# EasyEDA Pro project ProPrj_KrabbyUno - v0.1_2026-05-19.epro, board PCB2
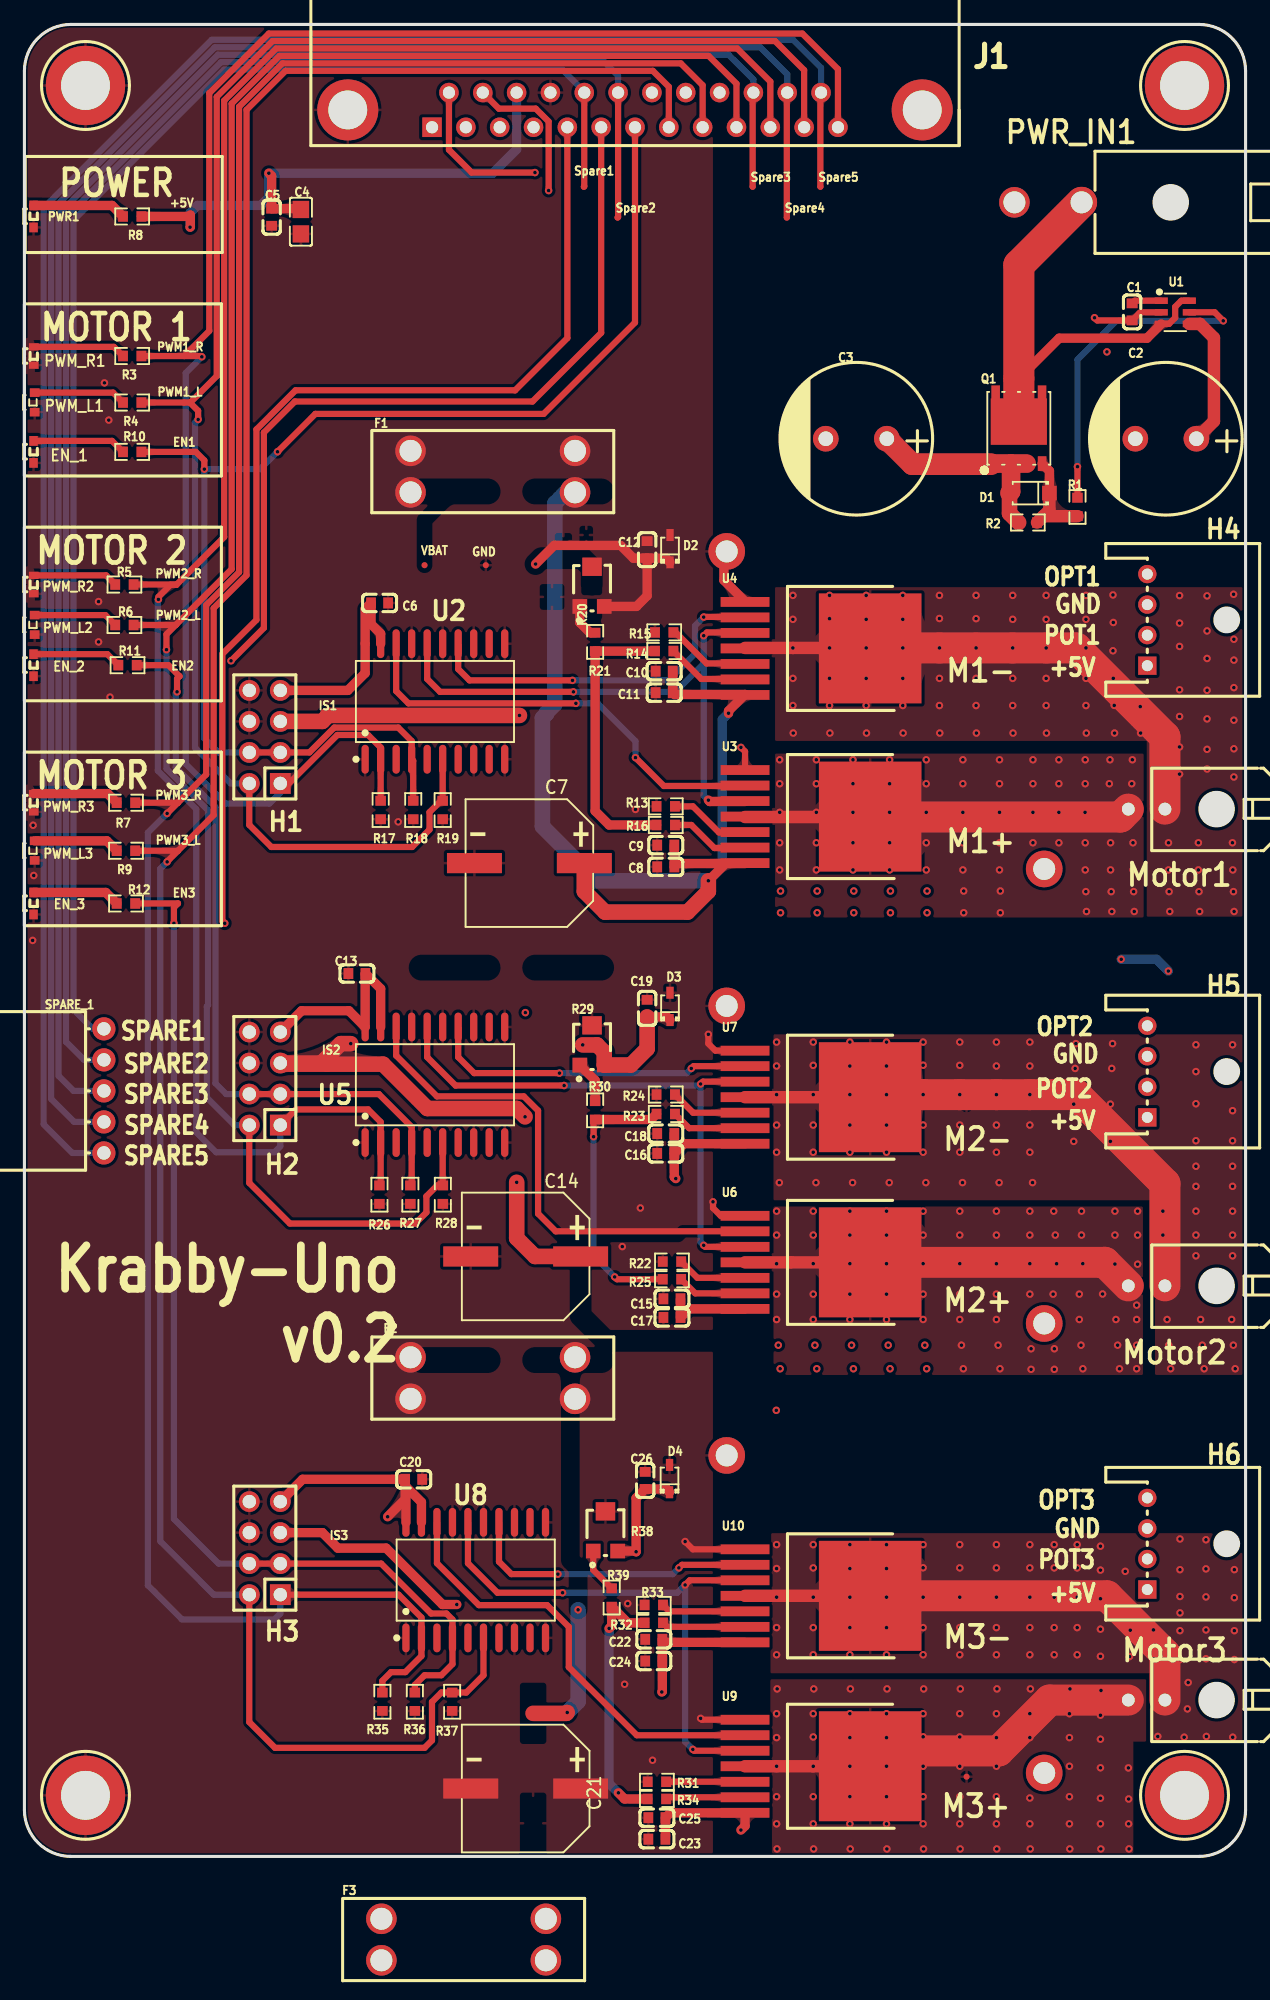
[diagram p8: board, top side]
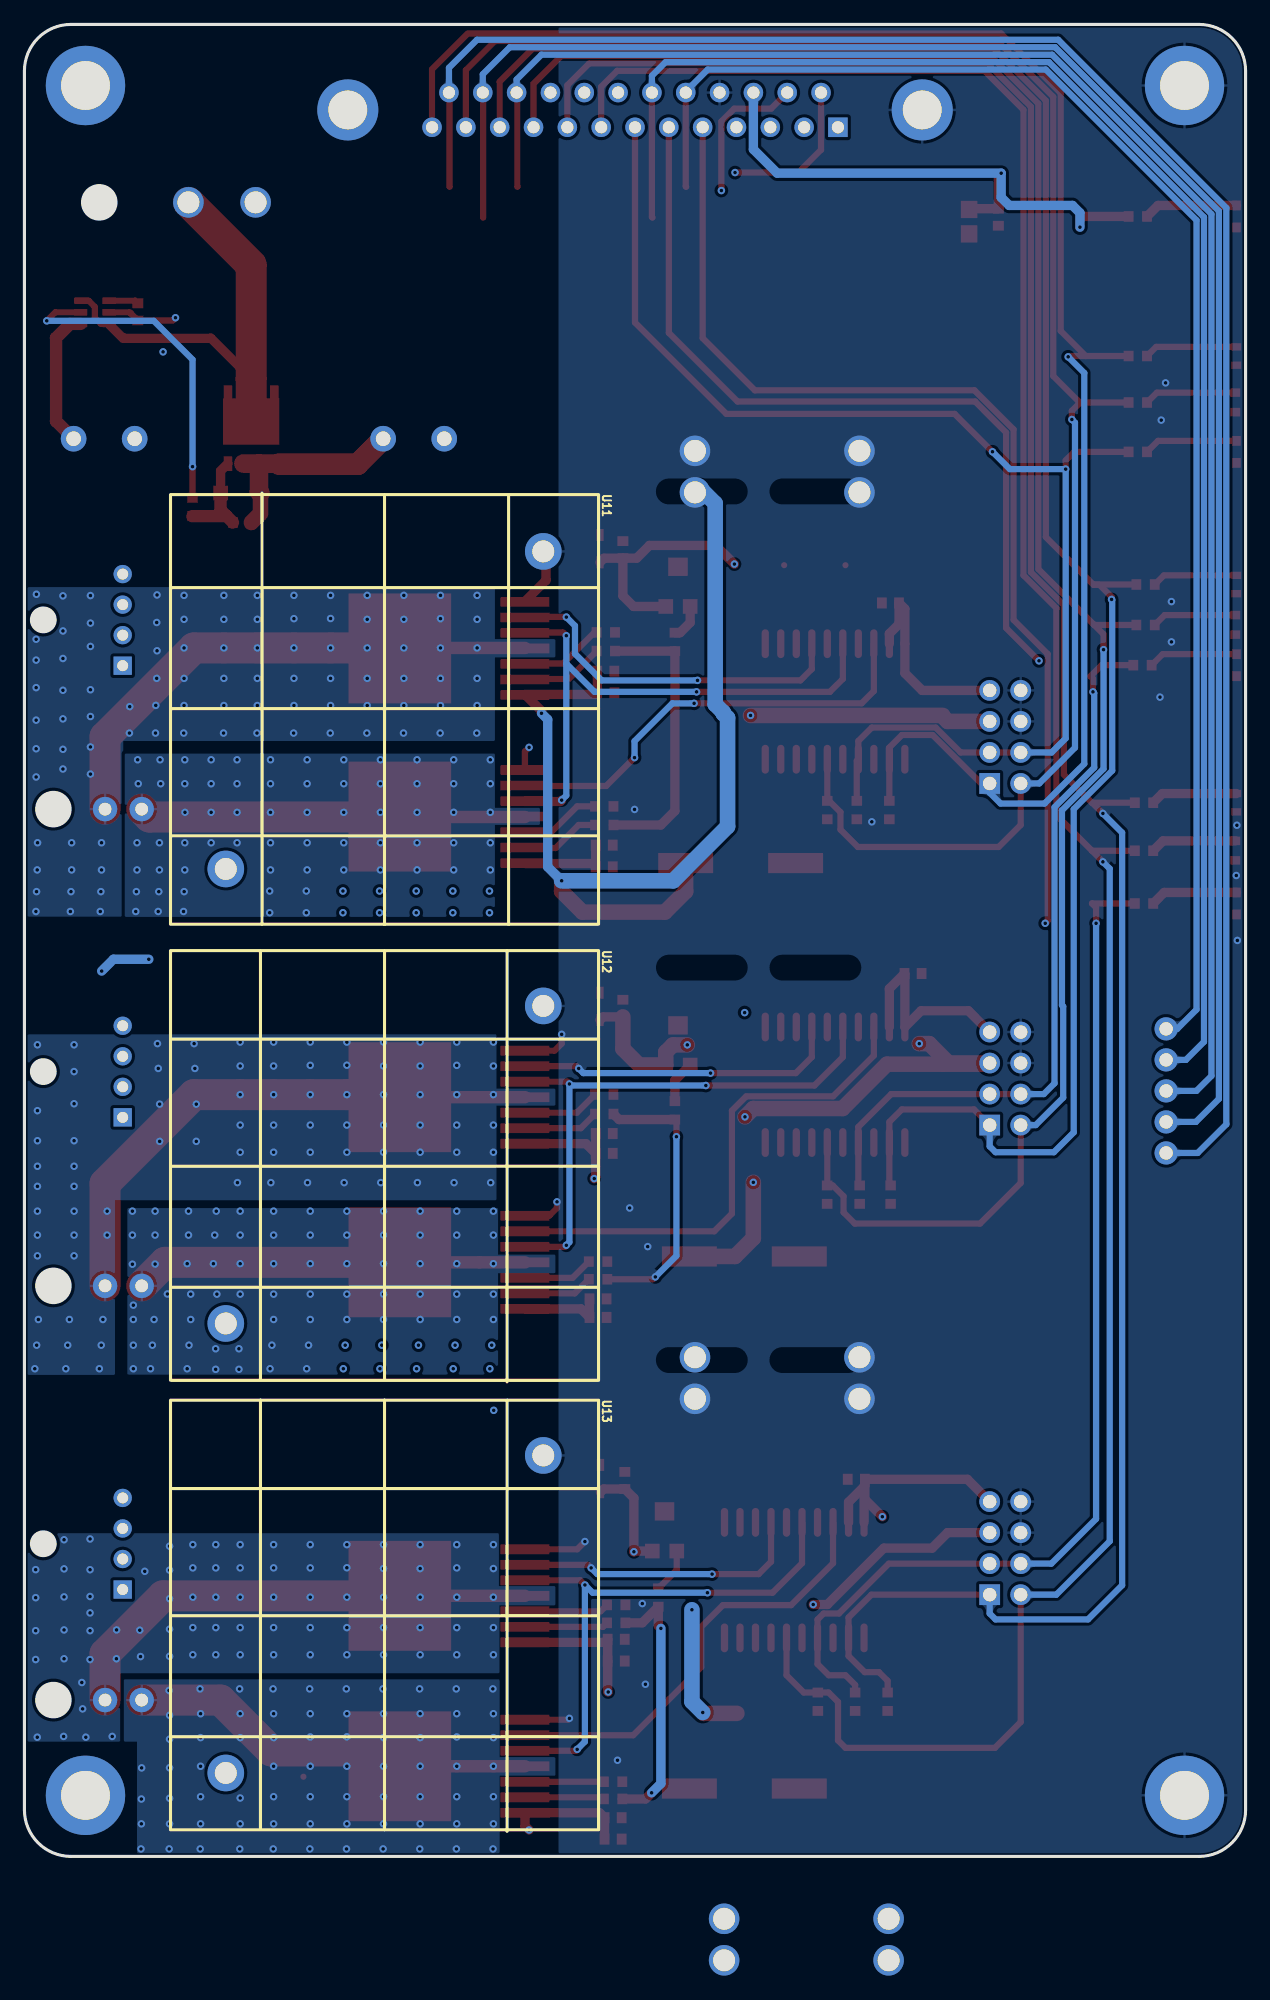
[diagram p9: board, bottom side, seen from below]

Outline 100 x 150 mm; copper layers: Top Layer, Inner1, Inner2, Bottom Layer. Coordinates in mm from the lower left corner of the outline.
Outline path: 0,146.19 0,3.81 arc(1.12,1.12) 3.81,0 96.19,0 arc(98.88,1.12) 100,3.81 100,146.19 arc(98.88,148.88) 96.19,150 3.81,150 arc(1.12,148.88) 0,146.19
Stack: Top Layer 0.035mm Outer layer thickness 1oz / Dielectric1 0.2104mm 7628 RC49% 8.6mil / Inner1 0.0152mm Inner layer thickness / Dielectric2 1.065mm 1.1mm H/HOZ Copper / Inner2 0.0152mm Inner layer thickness / Dielectric3 0.2104mm 7628 RC49% 8.6mil / Bottom Layer 0.035mm Outer layer thickness 1oz

## Design rules (mm)
template: Custom Config
spacing copperThickness1oz (default): track to track 0.102, other pairs 0.152 to 0.3
spacing copperThickness2oz: track to track 0.203, other pairs 0.152 to 0.3
track width copperThickness1oz (default): min 0.127, default 0.508, max 3.81
track width copperThickness2oz: min 0.203, default 0.254, max 2.54
differential pair differentialPair (default): width min 0.127, default 0.254, max 2.54; gap min 0.152, default 0.152
via viaSize (default): diameter min 0.5, default 0.61, max 10; hole min 0.3, default 0.305, max 6.3

## Placement (name value [footprint] x y rotation side)
+5V  -  [Test-Point-0.5mm]  13.59 134.39 270 top
C1  100nF  [C0603]  90.71 126.46 90 top
C2  1000uF  [CAP-TH_BD12.5-P5.00-D0.6-FD]  93.47 116.08 180 top
C3  1000uF  [CAP-TH_BD12.5-P5.00-D0.6-FD]  68.12 116.08 180 top
C4  4.7uF  [C0805]  22.64 133.85 90 top
C5  100nF  [C0603]  20.24 134.21 270 top
C6  100nF  [C0603]  29.08 102.63 180 top
C7  330uF  [CAP-SMD_BD10.0-L10.3-W10.3-LS11.0-FD]  41.35 81.33 180 top
C8  100nF  [C0603]  52.52 81.02 180 top
C9  1uF  [C0603]  52.52 82.8 180 top
C10  100nF  [C0603]  52.39 97.04 180 top
C11  1uF  [C0603]  52.39 95.28 180 top
C12  100nF  [C0603]  50.99 107 90 top
C13  100nF  [C0603]  27.23 72.29 0 top
C14  330uF  [CAP-SMD_BD10.0-L10.3-W10.3-LS11.0-FD]  41.05 49.12 180 top
C15  100nF  [C0603]  53.03 45.66 180 top
C16  1uF  [C0603]  52.52 57.56 180 top
C17  100nF  [C0603]  53.03 44.13 180 top
C18  1uF  [C0603]  52.52 59.19 180 top
C19  100nF  [C0603]  50.99 69.44 90 top
C20  100nF  [C0603]  31.88 30.88 180 top
C21  330uF  [CAP-SMD_BD10.0-L10.3-W10.3-LS11.0-FD]  41.05 5.56 180 top
C22  100nF  [C0603]  51.54 17.78 180 top
C23  1uF  [C0603]  51.79 1.41 180 top
C24  100nF  [C0603]  51.54 16 180 top
C25  1uF  [C0603]  51.79 3.17 180 top
C26  100nF  [C0603]  50.83 30.78 90 top
D1  KDZVTR12B  [SOD-123FL_L2.7-W1.8-LS3.8-RD]  82.3 111.63 180 top
D2  BZT52C5V1S  [SOD-323_L1.7-W1.3-LS2.5-RD-1]  52.87 107.08 90 top
D3  BZT52C5V1S  [SOD-323_L1.7-W1.3-LS2.5-RD-1]  52.87 69.6 90 top
D4  BZT52C5V1S  [SOD-323_L1.7-W1.3-LS2.5-RD-1]  52.83 30.94 90 top
EN1  -  [Test-Point-0.5mm]  13.08 115 0 top
EN2  -  [Test-Point-0.5mm]  12.7 96.63 0 top
EN3  -  [Test-Point-0.5mm]  12.57 78.03 0 top
EN_1  LTST-S270TGKT  [LED-SMD_L1.7-W0.6-RD_GREEN]  0.75 115 90 top
EN_2  LTST-S270TGKT  [LED-SMD_L1.7-W0.6-RD_GREEN]  0.75 97.54 90 top
EN_3  LTST-S270TGKT  [LED-SMD_L1.7-W0.6-RD_GREEN]  0.75 78.03 90 top
F1  3557-2  [FUSE-TH_4P-L19.8-W6.7_3557-2]  38.35 113.39 0 top
F2  3557-2  [FUSE-TH_4P-L19.8-W6.7_3557-2]  38.35 39.17 0 top
F3  3557-2  [FUSE-TH_4P-L19.8-W6.7_3557-2]  35.97 -6.81 0 top
GND  -  [Test-Point-0.5mm]  37.79 105.72 0 top
H1  PZ254V-12-8P  [HDR-TH_8P-P2.54-V-M-R2-C4-S2.54]  19.69 91.66 90 top
H2  PZ254V-12-8P  [HDR-TH_8P-P2.54-V-M-R2-C4-S2.54]  19.69 63.69 90 top
H3  PZ254V-12-8P  [HDR-TH_8P-P2.54-V-M-R2-C4-S2.54]  19.69 25.24 90 top
H4  S04B-XASK-1(LF)(SN)  [CONN-TH_S04B-XASK-1-LF-SN]  91.95 101.24 270 top
H5  S04B-XASK-1(LF)(SN)  [CONN-TH_S04B-XASK-1-LF-SN]  91.95 64.26 270 top
H6  S04B-XASK-1(LF)(SN)  [CONN-TH_S04B-XASK-1-LF-SN]  91.95 25.6 270 top
IS1  -  [Test-Point-0.5mm]  24.65 93.19 0 top
IS2  -  [Test-Point-0.5mm]  24.78 64.86 270 top
IS3  -  [Test-Point-0.5mm]  25.67 25.24 270 top
J1  D-DMR025PF-D002  [DB25-TH_D-DMR025PF-D002]  50 143 180 top
M1  SMTSO2025CTJ  [SMD-1_BD6.2-D3.6]  5 5 0 top
M1+  -  [Test-Point-0.5mm]  77.15 85.58 0 top
M1-  -  [Test-Point-0.5mm]  77.15 99.17 90 top
M2  SMTSO2025CTJ  [SMD-1_BD6.2-D3.6]  95 5 0 top
M2+  -  [Test-Point-0.5mm]  77.15 48.13 270 top
M2-  -  [Test-Point-0.5mm]  77.15 61.44 180 top
M3  SMTSO2025CTJ  [SMD-1_BD6.2-D3.6]  5 145 0 top
M3+  -  [Test-Point-0.5mm]  77.15 6.53 0 top
M3-  -  [Test-Point-0.5mm]  77.15 20.62 0 top
M4  SMTSO2025CTJ  [SMD-1_BD6.2-D3.6]  95 145 0 top
Motor1  430450200  [CONN-TH_43045-0200]  91.9 85.75 90 top
Motor2  430450200  [CONN-TH_43045-0200]  91.9 46.72 90 top
Motor3  430450200  [CONN-TH_43045-0200]  91.9 12.8 90 top
PWM1_L  -  [Test-Point-0.5mm]  13.08 119.04 0 top
PWM1_R  -  [Test-Point-0.5mm]  13.08 122.85 0 top
PWM2_L  -  [Test-Point-0.5mm]  12.45 100.88 270 top
PWM2_R  -  [Test-Point-0.5mm]  12.45 104.12 0 top
PWM3_L  -  [Test-Point-0.5mm]  12.57 82.34 180 top
PWM3_R  -  [Test-Point-0.5mm]  12.57 86.28 270 top
PWM_L1  XL-1606UBC  [LED-SMD_L1.7-W1.1-R-RD_BULE]  0.84 119.05 90 top
PWM_L2  XL-1606UBC  [LED-SMD_L1.7-W1.1-R-RD_BULE]  0.84 100.84 90 top
PWM_L3  XL-1606UBC  [LED-SMD_L1.7-W1.1-R-RD_BULE]  0.84 82.35 90 top
PWM_R1  XL-1606UYC  [LED-SMD_L1.7-W1.1-RD_27-21]  0.76 122.85 90 top
PWM_R2  XL-1606UYC  [LED-SMD_L1.7-W1.1-RD_27-21]  0.76 104.14 90 top
PWM_R3  XL-1606UYC  [LED-SMD_L1.7-W1.1-RD_27-21]  0.76 86.28 90 top
PWR1  LTST-S270TGKT  [LED-SMD_L1.7-W0.6-RD_GREEN]  0.75 134.28 90 top
PWR_IN1  768250002  [CONN-TH_768250002]  83.82 135.43 90 top
Q1  CJAC130SN06L  [PDFN-8_L5.8-W5.0-P1.27-LS6.0-BL]  81.43 116.94 0 top
R1  22R  [R0603]  86.23 110.49 270 top
R2  100K  [R0603]  82.17 109.22 0 top
R3  4.7K  [R0603]  8.83 122.85 180 top
R4  4.7K  [R0603]  8.83 119.04 180 top
R5  4.7K  [R0603]  8.19 104.14 180 top
R6  4.7K  [R0603]  8.19 100.83 180 top
R7  4.7K  [R0603]  8.32 86.28 180 top
R8  4.7K  [R0603]  8.83 134.28 180 top
R9  4.7K  [R0603]  8.32 82.34 180 top
R10  4.7K  [R0603]  8.83 115 180 top
R11  4.7K  [R0603]  8.44 97.54 180 top
R12  4.7K  [R0603]  8.32 78.03 180 top
R13  1K  [R0603]  52.52 85.98 180 top
R14  1K  [R0603]  52.39 98.69 0 top
R15  1K  [R0603]  52.39 100.22 0 top
R16  1K  [R0603]  52.52 84.45 0 top
R17  10K  [R0603]  29.17 85.67 90 top
R18  10K  [R0603]  31.84 85.67 90 top
R19  10K  [R0603]  34.25 85.67 90 top
R20  10kΩ  [RES-ADJ-SMD_3P-L3.0-W3.8-P1.75-BR]  46.48 103.97 270 top
R21  4.7K  [R0603]  46.74 99.44 90 top
R22  1K  [R0603]  53.03 48.7 180 top
R23  1K  [R0603]  52.52 60.79 0 top
R24  1K  [R0603]  52.52 62.38 0 top
R25  1K  [R0603]  53.03 47.26 0 top
R26  10K  [R0603]  29.07 54.18 90 top
R27  10K  [R0603]  31.6 54.18 90 top
R28  10K  [R0603]  34.26 54.18 90 top
R29  10kΩ  [RES-ADJ-SMD_3P-L3.0-W3.8-P1.75-BR]  46.48 66.42 270 top
R30  4.7K  [R0603]  46.74 61.09 90 top
R31  1K  [R0603]  51.79 6.11 180 top
R32  1K  [R0603]  51.54 19.12 0 top
R33  1K  [R0603]  51.54 20.59 0 top
R34  1K  [R0603]  51.79 4.7 0 top
R35  10K  [R0603]  29.31 12.66 90 top
R36  10K  [R0603]  31.97 12.66 90 top
R37  10K  [R0603]  35.03 12.66 90 top
R38  10kΩ  [RES-ADJ-SMD_3P-L3.0-W3.8-P1.75-BR]  47.58 26.63 270 top
R39  4.7K  [R0603]  48.09 21.2 90 top
Spare1  -  [Test-Point-0.5mm]  45.81 136.71 0 top
Spare2  -  [Test-Point-0.5mm]  48.58 134.19 0 top
Spare3  -  [Test-Point-0.5mm]  59.63 136.71 0 top
Spare4  -  [Test-Point-0.5mm]  62.43 134.19 0 top
Spare5  -  [Test-Point-0.5mm]  65.18 136.71 0 top
SPARE_1  BX-PM2.54-1-5PWZ  [HDR-TH_5P-P2.54-H-F-W10.0-N]  6.51 62.68 270 top
U1  LM74700QDBVRQ1  [SOT-23-6_L2.9-W1.6-P0.95-LS2.8-BL]  94.25 126.43 270 top
U2  SN74AHC244DWR  [SOIC-20_L13.0-W7.6-P1.27-LS10.3-BL]  33.62 94.56 0 top
U3  BTN8982TA  [TO-263-7_L10.2-W10.4-P1.27-LS14.4-TL]  64.13 85.14 0 top
U4  BTN8982TA  [TO-263-7_L10.2-W10.4-P1.27-LS14.4-TL]  64.13 98.91 0 top
U5  SN74AHC244DWR  [SOIC-20_L13.0-W7.6-P1.27-LS10.3-BL]  33.62 63.18 0 top
U6  BTN8982TA  [TO-263-7_L10.2-W10.4-P1.27-LS14.4-TL]  64.13 48.64 0 top
U7  BTN8982TA  [TO-263-7_L10.2-W10.4-P1.27-LS14.4-TL]  64.13 62.16 0 top
U8  SN74AHC244DWR  [SOIC-20_L13.0-W7.6-P1.27-LS10.3-BL]  36.96 22.62 0 top
U9  BTN8982TA  [TO-263-7_L10.2-W10.4-P1.27-LS14.4-TL]  64.13 7.38 0 top
U10  BTN8982TA  [TO-263-7_L10.2-W10.4-P1.27-LS14.4-TL]  64.13 21.34 0 top
U11  XSD188-663  [HEATSINK-SMD_XSD188-663]  70.51 93.85 90 bottom
U12  XSD188-663  [HEATSINK-SMD_XSD188-663]  70.51 56.64 270 bottom
U13  XSD188-663  [HEATSINK-SMD_XSD188-663]  70.51 19.83 270 bottom
VBAT  -  [Test-Point-0.5mm]  32.77 105.72 270 top

## Footprints (pads in the part's own frame, mm; a bottom-side part is the same pattern mirrored in y, then rotated)
C0603
  rect 0.8x0.9 smd: 1(-0.7,0) 2(0.7,0)
C0805
  rect 1.41x1.35 smd: 1(-1,0) 2(1,0)
CAP-SMD_BD10.0-L10.3-W10.3-LS11.0-FD
  rect 4.5x1.65 smd: 1(-4.5,0) 2(4.5,0)
CAP-TH_BD12.5-P5.00-D0.6-FD
  round 2.1 hole 1.2: 1(-2.5,0) 2(2.5,0)
CONN-TH_43045-0200
  round 2 hole 1.05: 1(0,-1.5) 2(0,1.5)
CONN-TH_768250002
  round 2.5 hole 1.8: 1(0,-2.75) 2(0,2.75)
CONN-TH_S04B-XASK-1-LF-SN
  rect 1.5x1.5 hole 0.9: 1(3.75,0)
  round 1.5 hole 0.9: 2(1.25,0) 3(-1.25,0) 4(-3.75,0)
DB25-TH_D-DMR025PF-D002
  rect 1.6x1.6 hole 1: 1(16.62,1.42)
  round 1.6 hole 1: 2(13.85,1.42) 3(11.08,1.42) 4(8.31,1.42) 5(5.54,1.42) 6(2.77,1.42) 7(0,1.42) 8(-2.77,1.42) 9(-5.54,1.42) 10(-8.31,1.42) 11(-11.08,1.42) 12(-13.85,1.42) 13(-16.62,1.42) 14(15.235,-1.42) 15(12.465,-1.42) 16(9.695,-1.42) 17(6.925,-1.42) 18(4.155,-1.42) 19(1.385,-1.42) 20(-1.385,-1.42) 21(-4.155,-1.42) 22(-6.925,-1.42) 23(-9.695,-1.42) 24(-12.465,-1.42) 25(-15.235,-1.42)
  round 5 hole 3.18: 26(23.52,0) 27(-23.52,0)
FUSE-TH_4P-L19.8-W6.7_3557-2
  round 2.5 hole 1.8: 1(-6.735,1.7) 2(-6.735,-1.7) 3(6.735,1.7) 4(6.735,-1.7)
HDR-TH_5P-P2.54-H-F-W10.0-N
  round 1.9 hole 1.1: 1(-5.08,0) 2(-2.54,0) 3(0,0) 4(2.54,0) 5(5.08,0)
HDR-TH_8P-P2.54-V-M-R2-C4-S2.54
  rect 1.7x1.7 hole 1.1: 1(-3.81,-1.27)
  round 1.7 hole 1.1: 2(-3.81,1.27) 3(-1.27,-1.27) 4(-1.27,1.27) 5(1.27,-1.27) 6(1.27,1.27) 7(3.81,-1.27) 8(3.81,1.27)
HEATSINK-SMD_XSD188-663
  round 3 hole 1.8: 1(-13,13) 2(13,-13)
LED-SMD_L1.7-W0.6-RD_GREEN
  rect 0.8x0.7 smd: 1(-0.9,0) 2(0.9,0)
LED-SMD_L1.7-W1.1-R-RD_BULE
  rect 0.7x0.8 smd: 1(0.8,0) 2(-0.8,0)
LED-SMD_L1.7-W1.1-RD_27-21
  rect 0.6x0.8 smd: 1(-0.75,0) 2(0.75,0)
PDFN-8_L5.8-W5.0-P1.27-LS6.0-BL
  rect 0.7x1.2 smd: 1(-1.905,-2.9) 2(-0.635,-2.9) 3(0.635,-2.9) 4(1.905,-2.9) 5(1.9,2.9) 6(0.64,2.9) 7(-0.63,2.9) 8(-1.9,2.9)
  rect 4.6x3.8 smd: 9(0,0.54)
R0603
  rect 0.806x0.864 smd: 1(-0.753,0) 2(0.753,0)
RES-ADJ-SMD_3P-L3.0-W3.8-P1.75-BR
  rect 1.2x1.2 smd: 1(1.625,-1) 3(1.625,1)
  rect 1.5x1.6 smd: 2(-1.625,0)
SMD-1_BD6.2-D3.6
  round 6.5 hole 4: 1(0,0)
SOD-123FL_L2.7-W1.8-LS3.8-RD
  rect 1.2x1.2 smd: 1(-1.635,0) 2(1.635,0)
SOD-323_L1.7-W1.3-LS2.5-RD-1
  rect 0.985x0.6 smd: 1(-1.117,0) 2(1.117,0)
SOIC-20_L13.0-W7.6-P1.27-LS10.3-BL
  oval 0.595x2.36 smd: 1(-5.715,-4.73) 2(-4.445,-4.73) 3(-3.175,-4.73) 4(-1.905,-4.73) 5(-0.635,-4.73) 6(0.635,-4.73) 7(1.905,-4.73) 8(3.175,-4.73) 9(4.445,-4.73) 10(5.715,-4.73) 11(5.715,4.73) 12(4.445,4.73) 13(3.175,4.73) 14(1.905,4.73) 15(0.635,4.73) 16(-0.635,4.73) 17(-1.905,4.73) 18(-3.175,4.73) 19(-4.445,4.73) 20(-5.715,4.73)
SOT-23-6_L2.9-W1.6-P0.95-LS2.8-BL
  rect 0.532x1.072 smd: 1(-0.95,-1.149) 2(0,-1.149) 3(0.95,-1.149) 4(0.95,1.149) 5(0,1.149) 6(-0.95,1.149)
Test-Point-0.5mm
  round 0.5 smd: 1(0,0)
TO-263-7_L10.2-W10.4-P1.27-LS14.4-TL
  rect 4x0.8 smd: 1(-5.122,3.81) 2(-5.122,2.54) 3(-5.122,1.27) 4(-5.122,0) 5(-5.122,-1.27) 6(-5.122,-2.54) 7(-5.122,-3.81)
  rect 8.4x9 smd: 8(5.122,0)

## Nets
As in the schematic.

Pads without a net: U2 3 5 7 9 12; U5 3 5 7 9 12; U8 3 5 7 9 12

## Via types
v1: diameter 0.61, hole 0.305, Top Layer to Bottom Layer, 572 vias

## Routing (per net, layer and track width the routed paths; a pad name or vN(x,y) marks a point on that pad's centre or on a via; arc(x,y) is an arc through that point)
+5V: length 340.5
  Top Layer w0.762: v1(20.02,137.82) 20.24,137.59 C5.1 22.58,134.91 C4.2 ; 31.24,30.28 31.18,30.34 ; 31.24,30.28 32.51,29.01 U8.19 ; 31.24,30.28 U8.20 ; 31.18,30.34 31.18,29.25 v1(29.74,27.81) ; 31.18,30.34 31.18,30.88 22.78,30.88 H3.7 ; H2.7 22.7,69.24 26.57,69.24 U5.20 27.9,72.26 C13.2 29.17,71.05 U5.19 ; v1(13.56,133.4) 13.59,133.43 +5V.1 13.48,134.28 R8.1 ; H1.7 26.49,95.47 27.9,96.89 U2.20 27.9,102.15 C6.2 28.38,100.9 29.17,100.11 U2.19
  Inner2 w0.762: H4.1 88.96,97.49 87.81,96.34 87.81,75.46 v1(89.81,73.46) ; v1(20.02,137.82) 19.76,137.57 19.76,112.42 20.95,111.23 H1.7 22.81,93.62 22.81,84.43 20.95,82.58 H2.7 21.5,67.5 22.91,66.09 22.91,31.01 H3.7 ; H5.1 93.68,62.23 v1(93.68,72.49) ; v1(29.74,27.81) 28.85,26.92 28.85,17.83 31.44,15.24 90.56,15.24 91.62,16.3 91.62,21.52 H6.1
  Bottom Layer w0.762: v1(93.68,72.49) 92.71,73.46 v1(89.81,73.46) ; v1(13.56,133.4) 13.56,134.57 14.17,135.18 19.36,135.18 20.02,135.84 v1(20.02,137.82) 38.35,137.82 40.31,139.77 J1.16
GND: length 29
  Top Layer w0.508: U6.1 57.02,52.45 56.39,53.09 v1(56.39,53.59) ; U1.2 91.4,126.43 91.33,126.36 91.3,126.36 C1.1 87.85,125.76 v1(87.63,125.98) ; v1(55.37,11.3) 55.48,11.19 U9.1 ; v1(54.1,25.78) 54.74,25.15 U10.1 ; v1(56.01,67.31) 56.01,66.55 56.58,65.97 59.01,65.97 ; v1(58.67,90.81) 59.01,90.47 59.01,88.92
  Top Layer w0.762: U11.2 57.28,106.62 57.28,104.49 59.01,102.76
  vias: v1(0.71,84.43) v1(0.67,75) v1(0.76,80.31) v1(6.07,102.74) v1(6.07,99.44) v1(6.55,120.65) v1(6.91,117.6) v1(7.01,94.92) v1(30.61,84.71) v1(48.96,49.93) v1(49.15,14.1) v1(49.4,20.7) v1(50.04,85.72) v1(50.44,53.09) v1(51.44,7.87) v1(61.57,36.53) v1(61.73,41.86) v1(61.92,79.05) v1(61.92,77.27) v1(61.89,39.93) v1(64.73,41.86) v1(64.92,79.05) v1(64.92,77.27) v1(64.89,39.93) v1(67.73,41.86) v1(67.92,79.05) v1(67.92,77.27) v1(67.89,39.93) v1(70.73,41.86) v1(70.92,79.05) v1(70.92,77.27) v1(70.89,39.93) v1(73.73,41.86) v1(73.92,79.05) v1(73.92,77.27) v1(73.89,39.93) v1(88.65,123.19)
VBAT: length 28.5
  Top Layer w1.016: C2.1 97.41,117.52 97.41,124.33 96.26,125.48 U1.4
  Top Layer w1.27: D1.2 80.67,109.97 R2.1
  Top Layer w1.524: Q1.3 Q1.2 ; Q1.2 80.8,111.75 D1.2 ; Q1.2 Q1.1
  Top Layer w1.778: 79.15,114 72.71,114 C3.1
VBAT_FUSED: length 37.2
  Top Layer w0.508: U1.3 93.73,125.48 94.23,125.98 94.23,126.87 94.74,127.38 U1.6
  Top Layer w0.762: 81.43,121.01 84.73,124.31 91.93,124.31 U1.3
  Top Layer w2.54: Q1.9 81.43,130.3 PWR_IN1.1
VBAT_M1: length 92.7
  Top Layer w0.762: 57.42,81.3 53.49,81.3 C8.1 C9.1 ; 57.42,81.3 v1(56.01,79.88) ; 57.42,81.3 59.01,81.3 ; v1(57.66,93.6) 57.66,93.78 59.01,95.14 53.24,95.14 53.09,95.28 53.09,97.04
  Top Layer w1.27: C7.1 45.85,79.02 47.55,77.32 54.31,77.32 56.01,79.02 v1(56.01,79.88)
  Bottom Layer w0.762: v1(56.01,79.88) 57.15,81.03 57.15,93.09 v1(57.66,93.6)
  Bottom Layer w1.27: 44.65,112 43.43,110.78 43.43,94.34 42.77,93.67 42.77,93.57 42.42,93.22 42.42,84.33 46.86,79.88 v1(56.01,79.88)
VBAT_M2: length 48.9
  Top Layer w0.762: v1(53.34,55.5) 53.22,55.62 C16.1 ; C15.1 C17.1 54.43,44.83 U6.7 ; C18.1 C16.1 ; C16.1 54.01,58.36 59.01,58.36
  Top Layer w1.27: v1(40.31,55.19) 40.31,50.62 41.81,49.12 C14.1
  Inner2 w1.27: 44.53,72.77 47.19,70.11 47.19,62.08 v1(40.31,55.19)
  vias: v1(41.02,69.09)
VBAT_M3: length 32.8
  Top Layer w0.762: C23.1 C25.1 52.9,3.57 U9.7 59.01,2.5 v1(58.67,2.16) ; U10.7 52.49,17.53 52.24,17.78 52.24,13.5 v1(52.2,13.46)
  Top Layer w1.27: 41.66,11.71 44.38,11.71 v1(44.45,11.79)
  Bottom Layer w1.27: v1(45.34,20.19) 45.34,12.67 v1(44.45,11.79)
EN1: length 108.1
  Top Layer w0.508: H1.4 H1.3 23.34,90.39 25.37,92.43 30.61,92.43 31.71,91.33 U2.4 31.84,89.71 R18.2 ; v1(14.73,113.59) 14.73,114.3 14.03,115 EN1.1 R10.1 ; v1(20.73,115.01) 23.83,118.11 42.52,118.11 50,125.59 J1.7
  Bottom Layer w0.508: v1(20.73,115.01) 19.3,113.59 v1(14.73,113.59) 14.73,91.54 15.88,90.39 H1.4
EN1_BUF: length 47.1
  Top Layer w0.508: v1(55.63,99.95) 55.9,100.22 59.01,100.22 ; U2.16 32.98,96.41 34.04,95.35 v1(44.96,95.35)
  Top Layer w0.762: v1(56.01,86.49) 56.12,86.38 59.01,86.38
  Bottom Layer w0.508: 55.63,97.66 v1(55.63,99.95) ; 55.63,97.66 55.63,86.87 v1(56.01,86.49) ; 55.63,97.66 53.31,95.35 v1(44.96,95.35)
EN2: length 134.2
  Top Layer w0.508: v1(16.92,97.89) 19.61,100.58 19.61,116.59 22.15,119.13 41.6,119.13 47.23,124.75 J1.6 ; H2.4 H2.3 29.02,62.42 31.71,59.73 U5.4 31.71,55.04 R27.2 ; v1(12.5,95.35) 12.5,96.43 EN2.1 11.8,97.54 9.2,97.54
  Inner2 w0.508: v1(16.92,97.89) 15.04,97.89 v1(12.5,95.35)
  Bottom Layer w0.508: v1(12.5,95.35) 12.39,95.25 12.39,89.15 15.65,85.9 15.65,63.3 16.52,62.42 H2.4
EN2_BUF: length 46.3
  Top Layer w0.508: v1(55.63,50.04) 55.75,49.91 U6.3 ; v1(55.37,63.25) 55.56,63.44 59.01,63.44 ; U5.16 32.98,65.44 35.31,63.12 v1(44.2,63.12)
  Bottom Layer w0.508: v1(44.2,63.12) 55.25,63.12 v1(55.37,63.25) 55.37,50.29 v1(55.63,50.04)
EN3: length 180
  Top Layer w0.508: v1(12.24,76.4) 12.24,77.7 EN3.1 R12.1 ; R36.2 31.97,14.04 32.77,14.83 34.14,14.83 35.05,15.75 U8.4 35.05,19.39 34.56,19.89 33.3,19.89 29.22,23.97 H3.3 H3.4 ; J1.5 44.46,124.32 40.18,120.04 22.2,120.04 19,116.84 19,101.24 16.21,98.45 16.21,76.61 v1(16.41,76.4)
  Inner2 w0.508: v1(12.24,76.4) v1(16.41,76.4)
  Bottom Layer w0.508: H3.4 15.91,23.97 12.24,27.63 v1(12.24,76.4)
EN3_BUF: length 45.5
  Top Layer w0.508: U9.3 54.85,8.65 v1(54.74,8.76) ; U8.16 36.32,24 38.74,21.59 v1(44.07,21.59) ; v1(54.1,22.22) 54.48,22.61 U10.3
  Bottom Layer w0.508: v1(44.07,21.59) 53.47,21.59 v1(54.1,22.22) 54.1,9.4 v1(54.74,8.76)
IS1: length 89.1
  Top Layer w0.762: D2.1 52.53,106.3 C12.1 ; C12.1 49.86,106.3 48.82,107.34 43.38,107.34 v1(41.86,105.82) ; C12.1 50.99,103.22 50.12,102.34 R20.3
  Top Layer w1.27: H1.5 24.4,92.93 IS1.1 ; 24.79,93.42 v1(40.54,93.42)
  Inner2 w1.27: J1.4 39.78,139.67 39.78,107.9 v1(41.86,105.82) 40.54,104.5 v1(40.54,93.42)
IS1_RAW: length 23.5
  Top Layer w0.762: R16.1 47.88,84.45 46.74,85.6 R21.1 51.63,98.69 R14.1
IS2: length 129.9
  Top Layer w0.762: D3.1 52.61,68.74 C19.1
  Top Layer w1.27: v1(45.72,66.45) 46.89,66.45 47.48,65.85 R29.3 49.66,64.8 50.99,66.13 C19.1 ; v1(41,60.55) 40.31,61.24 33,61.24 29.37,64.86 IS2.1 21.05,64.86 20.95,64.96 24.32,64.96 25.91,66.55 v1(26.72,66.55)
  Inner2 w1.27: J1.3 37.29,139.95 37.29,124.61 28.5,115.82 28.5,68.33 v1(26.72,66.55) ; v1(41,60.55) 41,65.13 42.32,66.45 v1(45.72,66.45)
IS2_RAW: length 22.9
  Top Layer w0.508: v1(46.61,58.93) 46.61,60.21 R30.1 ; v1(48.34,47.45) 48.53,47.26 R25.1
  Top Layer w0.762: R23.1 51.31,60.33 R30.1
  Bottom Layer w0.508: v1(48.34,47.45) 46.61,49.17 v1(46.61,58.93)
IS3: length 166.5
  Top Layer w0.762: v1(35.41,20.62) 34.24,20.62 29.62,25.24 IS3.1 24.4,26.51 H3.5 ; D4.1 52.56,30.08 C26.1 50.09,29.34 v1(50.09,24.94) 50.03,25 R38.3
  Inner2 w0.762: v1(50.09,24.94) 36.83,24.94 35.41,23.52 v1(35.41,20.62)
  Inner2 w1.27: J1.2 31.22,136.65 31.22,123.27 24.94,116.99 24.94,28.85 22.6,26.51 H3.5
IS3_RAW: length 21.5
  Top Layer w0.762: R32.1 49.41,19.12 R39.1 48.09,18.88 v1(47.88,18.67) ; R34.1 49.14,4.7 v1(48.64,5.21)
  Bottom Layer w0.762: v1(48.64,5.21) 47.88,5.97 v1(47.88,18.67)
M1+: length 31.7
  Top Layer w1.016: 59.01,85.11 69.26,85.11
  Top Layer w2.54: 69.26,85.11 89.75,85.11 Motor1.2
  vias: v1(61.85,89.79) v1(61.85,87.83) v1(61.85,85.49) v1(61.85,83) v1(61.85,80.77) v1(64.85,89.79) v1(64.85,87.83) v1(64.85,85.49) v1(64.85,83) v1(64.85,80.77) v1(67.85,89.79) v1(67.85,87.83) v1(67.85,85.49) v1(67.85,83) v1(67.85,80.77) v1(70.85,89.79) v1(70.85,87.83) v1(70.85,85.49) v1(70.85,83) v1(70.85,80.77) v1(73.85,89.79) v1(73.85,87.83) v1(73.85,85.49) v1(73.85,83) v1(73.85,80.77) v1(76.85,89.79) v1(76.85,87.83) v1(76.85,85.49) v1(76.85,83) v1(76.85,80.77) v1(76.92,79.05) v1(76.92,77.27) v1(79.85,89.79) v1(79.85,87.83) v1(79.85,85.49) v1(79.85,83) v1(79.85,80.77) v1(79.92,79.05) v1(79.92,77.27) v1(82.59,89.79) v1(82.59,87.83) v1(82.59,85.49) v1(82.59,83) v1(84.71,89.79) v1(84.71,87.83) v1(84.71,85.49) v1(84.71,83) v1(86.87,89.79) v1(86.87,87.83) v1(86.85,85.49) v1(86.87,83) v1(86.87,80.77) v1(86.92,78.99) v1(86.97,77.37) v1(88.84,87.83) v1(88.89,89.79) v1(88.94,83) v1(88.94,80.77) v1(89,78.99) v1(89.05,77.37) v1(90.73,89.79) v1(90.68,87.83) v1(90.78,83) v1(90.78,80.77) v1(90.83,78.99) v1(90.88,77.37)
M1-: length 43.3
  Top Layer w1.016: 59.01,98.95 v1(62.93,98.95) v1(65.93,98.95) v1(68.93,98.95) 69.26,98.95
  Top Layer w2.54: 69.26,98.95 v1(71.93,98.95) v1(74.93,98.95) v1(77.93,98.95) v1(80.93,98.95) v1(83.67,98.95) 86.12,98.95 93.4,91.67 Motor1.1
  vias: v1(62.93,103.25) v1(62.93,101.29) v1(62.93,96.46) v1(62.93,94.23) v1(62.96,91.98) v1(65.93,103.25) v1(65.93,101.35) v1(65.93,96.46) v1(65.93,94.23) v1(65.96,91.98) v1(68.93,103.25) v1(68.93,101.29) v1(68.93,96.46) v1(68.93,94.23) v1(68.96,91.98) v1(71.93,103.25) v1(71.93,101.29) v1(71.93,96.46) v1(71.93,94.23) v1(71.96,91.98) v1(74.93,103.25) v1(74.93,101.36) v1(74.93,96.46) v1(74.93,94.23) v1(74.96,91.98) v1(77.93,103.25) v1(77.93,101.35) v1(77.93,96.46) v1(77.93,94.23) v1(77.96,91.98) v1(80.93,103.25) v1(80.93,101.29) v1(80.93,96.46) v1(80.93,94.23) v1(80.96,91.98) v1(83.67,103.25) v1(83.67,101.29) v1(83.67,96.46) v1(83.67,94.23) v1(83.69,91.98) v1(86.93,103.25) v1(86.93,101.29) v1(86.93,98.95) v1(86.93,96.46) v1(86.93,94.23) v1(86.96,91.98) v1(89.14,103.29) v1(89.14,98.71) v1(89.17,101.03) v1(89.17,96.46) v1(89.24,94.24) v1(89.27,91.98) v1(91.38,94.14) v1(91.4,91.98) v1(93.69,83) v1(93.69,80.77) v1(93.74,78.99) v1(93.79,77.37) v1(94.59,103.24) v1(94.59,100.98) v1(94.59,99.07) v1(94.59,95.52) v1(94.59,93.33) v1(94.59,90.84) v1(94.59,88.62) v1(96.13,83) v1(96.13,80.77) v1(96.19,78.99) v1(96.24,77.37) v1(96.85,103.21) v1(96.85,100.34) v1(96.85,98.08) v1(96.85,95.48) v1(96.85,93.14) v1(96.85,90.65) v1(96.85,89.03) v1(98.93,83) v1(99.02,103.34) v1(99.04,99.66) v1(99.04,97.95) v1(99.04,95.7) v1(99.04,93.03) v1(99.04,90.69) v1(99.04,88.38) v1(98.96,80.77) v1(99.01,78.99) v1(99.06,77.37)
M2+: length 32.2
  Top Layer w1.016: U6.8 U6.4
  Top Layer w2.54: U6.8 88.47,48.64 Motor2.2
  vias: v1(61.59,52.83) v1(61.59,50.87) v1(61.59,48.53) v1(61.59,46.04) v1(61.59,43.96) v1(64.59,52.83) v1(64.59,50.87) v1(64.59,48.53) v1(64.59,46.04) v1(64.59,43.96) v1(67.59,52.83) v1(67.59,50.87) v1(67.59,48.53) v1(67.59,46.04) v1(67.59,43.96) v1(70.59,52.83) v1(70.59,50.87) v1(70.59,48.53) v1(70.59,46.04) v1(70.59,43.96) v1(73.59,52.83) v1(73.59,50.87) v1(73.59,48.53) v1(73.59,46.04) v1(73.59,43.96) v1(76.59,52.83) v1(76.59,50.87) v1(76.59,48.53) v1(76.59,46.04) v1(76.59,43.96) v1(76.73,41.86) v1(76.89,39.93) v1(79.59,52.83) v1(79.59,50.87) v1(79.59,48.53) v1(79.59,46.04) v1(79.59,43.96) v1(79.73,41.86) v1(79.89,39.93) v1(82.33,52.83) v1(82.33,50.87) v1(82.33,48.53) v1(82.33,46.04) v1(82.44,41.56) v1(82.43,39.88) v1(84.24,46.04) v1(84.29,52.83) v1(84.34,41.56) v1(84.34,39.88) v1(84.42,50.87) v1(84.53,48.53) v1(86.38,46.04) v1(86.38,43.96) v1(86.52,41.86) v1(86.56,52.83) v1(86.56,50.87) v1(86.67,48.53) v1(86.68,39.93) v1(88.29,46.05) v1(89.3,52.83) v1(89.3,50.87) v1(89.3,48.5) v1(89.38,43.96) v1(89.52,41.86) v1(89.68,39.93) v1(91.08,45.13) v1(91.08,43.96) v1(91.08,41.86) v1(91.08,39.93) v1(91.16,52.83) v1(91.16,50.87) v1(91.16,48.49)
M2-: length 44.4
  Top Layer w1.016: U7.4 U7.8
  Top Layer w2.54: v1(70.59,62.37) v1(73.59,62.37) v1(76.59,62.37) v1(79.59,62.37) v1(82.33,62.37) 86.12,62.37 93.4,55.09 Motor2.1
  vias: v1(61.59,66.68) v1(61.59,64.72) v1(61.59,62.37) v1(61.59,59.88) v1(61.59,57.66) v1(61.82,55.17) v1(64.59,66.68) v1(64.59,64.77) v1(64.59,62.37) v1(64.59,59.88) v1(64.59,57.66) v1(64.82,55.17) v1(67.59,66.68) v1(67.59,64.72) v1(67.59,62.37) v1(67.59,59.88) v1(67.59,57.66) v1(67.82,55.17) v1(70.59,66.68) v1(70.59,64.72) v1(70.59,59.88) v1(70.59,57.66) v1(70.82,55.17) v1(73.59,66.68) v1(73.59,64.78) v1(73.59,59.88) v1(73.59,57.66) v1(73.82,55.17) v1(76.59,66.68) v1(76.59,64.77) v1(76.59,59.88) v1(76.59,57.66) v1(76.82,55.17) v1(79.59,66.68) v1(79.59,64.72) v1(79.59,59.88) v1(79.59,57.66) v1(79.82,55.17) v1(82.33,66.68) v1(82.33,64.72) v1(82.33,59.88) v1(82.33,57.66) v1(82.56,55.17) v1(85.93,61.59) v1(85.93,58.55) v1(86.04,64.52) v1(86.11,66.55) v1(88.93,61.59) v1(88.93,58.55) v1(89.04,64.52) v1(89.11,66.55) v1(93.23,52.83) v1(93.23,50.87) v1(93.57,43.96) v1(93.71,41.86) v1(93.86,39.93) v1(95.93,66.45) v1(95.93,64.26) v1(95.93,61.63) v1(95.93,58.6) v1(95.93,56.51) v1(95.93,54.86) v1(95.93,52.83) v1(95.93,50.87) v1(95.93,49.17) v1(96.32,43.96) v1(96.46,41.86) v1(96.61,39.93) v1(98.93,66.45) v1(98.93,61.06) v1(98.93,58.6) v1(98.93,56.51) v1(98.93,54.86) v1(98.93,52.83) v1(98.93,50.87) v1(98.93,49.17) v1(98.86,43.96) v1(99,41.86) v1(99.15,39.93)
M3+: length 33.6
  Top Layer w1.016: 69.26,7.38 v1(67.59,7.38) v1(64.59,7.38) v1(61.59,7.38) 59.01,7.38
  Top Layer w2.54: 69.26,7.38 70.51,8.64 79.78,8.64 83.95,12.8 Motor3.2
  vias: v1(61.64,13.72) v1(61.59,11.69) v1(61.59,9.73) v1(61.59,4.89) v1(61.59,2.67) v1(61.63,0.61) v1(64.64,13.72) v1(64.59,11.69) v1(64.59,9.78) v1(64.59,4.89) v1(64.59,2.67) v1(64.63,0.61) v1(67.64,13.72) v1(67.59,11.69) v1(67.59,9.73) v1(67.59,4.89) v1(67.59,2.67) v1(67.63,0.61) v1(70.64,13.72) v1(70.59,11.69) v1(70.59,9.73) v1(70.59,7.38) v1(70.59,4.89) v1(70.59,2.67) v1(70.63,0.61) v1(73.64,13.72) v1(73.59,11.69) v1(73.59,9.79) v1(73.59,7.38) v1(73.59,4.89) v1(73.59,2.67) v1(73.63,0.61) v1(76.64,13.72) v1(76.59,11.69) v1(76.59,9.78) v1(76.59,7.38) v1(76.59,4.89) v1(76.59,2.67) v1(76.63,0.61) v1(79.64,13.72) v1(79.59,11.69) v1(79.59,9.73) v1(79.59,7.38) v1(79.59,4.89) v1(79.59,2.67) v1(79.63,0.61) v1(82.33,11.69) v1(82.33,9.73) v1(82.33,4.78) v1(82.33,2.67) v1(82.38,13.72) v1(82.36,0.61) v1(85.62,13.72) v1(85.58,11.68) v1(85.58,9.72) v1(85.58,7.38) v1(85.58,4.89) v1(85.58,2.67) v1(85.61,0.61) v1(88.12,11.56) v1(88.12,9.6) v1(88.12,7.25) v1(88.12,4.76) v1(88.12,2.67) v1(88.15,0.61) v1(88.16,13.59) v1(90.4,7.25) v1(90.42,4.7) v1(90.42,2.67) v1(90.46,0.61)
M3-: length 40.1
  Top Layer w1.016: U10.4 U10.8
  Top Layer w2.54: U10.8 88.65,21.34 93.4,16.59 Motor3.1
  vias: v1(61.59,25.53) v1(61.59,23.57) v1(61.59,21.23) v1(61.59,18.73) v1(61.59,16.51) v1(64.59,25.53) v1(64.59,23.62) v1(64.59,21.23) v1(64.59,18.73) v1(64.59,16.51) v1(67.59,25.53) v1(67.59,23.57) v1(67.59,21.23) v1(67.59,18.73) v1(67.59,16.51) v1(70.59,25.53) v1(70.59,23.57) v1(70.59,21.23) v1(70.59,18.73) v1(70.59,16.51) v1(73.59,25.53) v1(73.59,23.63) v1(73.59,21.23) v1(73.59,18.73) v1(73.59,16.51) v1(76.59,25.53) v1(76.59,23.62) v1(76.59,21.23) v1(76.59,18.73) v1(76.59,16.51) v1(79.59,25.53) v1(79.59,23.62) v1(79.59,21.23) v1(79.59,18.73) v1(79.59,16.51) v1(82.33,25.53) v1(82.33,23.62) v1(82.33,21.23) v1(82.33,18.73) v1(82.33,16.51) v1(84.33,25.53) v1(84.33,23.62) v1(84.33,21.23) v1(84.33,18.73) v1(84.33,16.51) v1(86.21,25.53) v1(86.21,23.62) v1(86.21,21.23) v1(86.21,18.73) v1(86.21,16.51) v1(88.12,25.4) v1(88.12,23.44) v1(88.12,21.1) v1(88.12,18.61) v1(88.12,16.38) v1(90.14,23.34) v1(90.49,16.36) v1(90.56,18.52) v1(92.46,18.55) v1(92.47,16.18) v1(92.81,9.82) v1(94.63,25.99) v1(94.63,23.47) v1(94.63,21.28) v1(94.63,19.94) v1(94.63,18.48) v1(94.63,16.12) v1(94.97,9.76) v1(95.24,12.08) v1(95.3,14.24) v1(96.76,25.93) v1(96.76,23.54) v1(96.76,21.25) v1(96.76,18.54) v1(96.76,16.18) v1(96.79,9.82) v1(98.95,9.76) v1(99.08,23.48) v1(99.08,21.18) v1(99.08,18.48) v1(99.08,16.12)
OPT1: length 71.8
  Inner2 w0.508: J1.20 51.38,119.05 59.44,111 85.95,111 H4.4
OPT2: length 110.8
  Inner2 w0.508: H5.4 91.95,91.04 93.42,92.51 93.42,109.07 89.46,113.03 59.54,113.03 54.16,118.41 J1.21
OPT3: length 151.5
  Inner2 w0.508: H6.4 91.9,29.41 91.9,56.39 94.84,59.33 94.84,87.86 95.31,88.32 95.31,88.45 95.56,88.7 95.56,111.1 92.15,114.5 59.94,114.5 56.93,117.52 J1.22
POT1: length 91.6
  Inner2 w0.508: J1.1 34.95,143.15 47.36,143.15 48.44,142.08 48.44,120.53 62.84,106.12 89.05,106.12 90.32,104.85 90.32,101.62 H4.2
POT2: length 129.9
  Top Layer w0.508: v1(41.81,137.87) 36.63,137.87 34.76,139.73 J1.14
  Inner2 w0.508: v1(41.81,137.87) 44.2,137.87 47.45,134.62 47.45,115.88 49.33,114 49.33,76.25 53.41,72.17 81.35,72.17 82.45,71.07 89.26,71.07 90.47,69.85 90.47,64.49 H5.2
POT3: length 166.4
  Top Layer w0.508: v1(42.93,136.4) 42.93,142.05 41.87,143.1 38.85,143.1 J1.15
  Inner2 w0.508: H6.2 86.74,29.57 76.3,29.57 75.39,28.65 53.8,28.65 48.87,33.58 48.87,43.43 47.45,44.86 47.45,60.78 48.67,62 48.67,113.79 46.84,115.62 46.84,133.15 43.59,136.4 v1(42.93,136.4)
PWM1_L: length 145.7
  Top Layer w0.508: v1(14.22,117.65) 14.22,118.36 13.55,119.04 ; U2.6 R19.2 34.1,86.43 33.17,85.5 33.17,84.07 31.75,82.65 20.22,82.65 18.42,84.45 H1.2 ; 13.55,119.04 PWM1_L.1 R4.1 ; 13.55,119.04 13.58,119.04 15.75,121.21 15.75,144.07 20.32,148.64 61.47,148.64 63.85,146.26 J1.12
  Bottom Layer w0.508: v1(14.22,117.65) 13.97,117.4 13.97,90.78 16.9,87.85 H1.2
PWM1_L_BUF: length 29.4
  Top Layer w0.508: v1(44.88,96.29) 36.45,96.29 35.52,97.22 U2.14 ; v1(55.63,101.47) 55.64,101.49 59.01,101.49
  Bottom Layer w0.508: v1(55.63,101.47) 54.91,100.76 54.91,98.48 52.73,96.29 v1(44.88,96.29)
PWM1_R: length 145.6
  Top Layer w0.508: R17.2 U2.2 29.17,90.79 28.14,91.82 25.63,91.82 21.66,87.85 H1.1 ; PWM1_R.1 15.14,124.91 15.14,144.37 20.02,149.25 63.7,149.25 66.62,146.33 J1.13 ; PWM1_R.1 14.46,122.85 v1(14.53,122.78) ; PWM1_R.1 R3.1
  Bottom Layer w0.508: v1(14.53,122.78) 13.21,121.46 13.21,89.46 16.46,86.21 20.07,86.21 20.95,87.1 H1.1
PWM1_R_BUF: length 36.5
  Top Layer w0.508: v1(45.16,94.41) 31.44,94.41 30.44,95.42 U2.18 ; v1(50.04,89.97) 52.36,87.64 59.01,87.64
  Bottom Layer w0.508: v1(45.16,94.41) 46.94,94.41 50.04,91.31 v1(50.04,89.97)
PWM2_L: length 167.9
  Top Layer w0.508: R6.1 12.39,100.83 ; 12.39,100.83 PWM2_L.1 16.97,105.4 16.97,143.51 20.88,147.42 56.03,147.42 58.31,145.14 J1.10 ; 12.39,100.83 11.63,100.07 v1(11.63,98.81) ; U5.6 34.25,54.95 R28.2 33.8,54.94 32.92,54.05 32.92,52.73 32,51.82 21.74,51.82 18.42,55.14 18.42,59.88
  Bottom Layer w0.508: 18.42,59.88 17.18,59.88 14.94,62.13 14.94,69.6 15.04,69.7 15.04,85.65 11.63,89.05 v1(11.63,98.81)
PWM2_L_BUF: length 26.7
  Top Layer w0.508: U7.2 54.8,64.7 v1(54.61,64.52) ; v1(43.81,64.14) 36.83,64.14 35.52,65.44 U5.14
  Bottom Layer w0.508: v1(54.61,64.52) 54.23,64.14 v1(43.81,64.14)
PWM2_R: length 167.1
  Top Layer w0.508: v1(10.97,102.92) 10.97,103.12 11.97,104.12 PWM2_R.1 ; PWM2_R.1 16.36,108.03 16.36,143.76 20.62,148.03 58.37,148.03 61.08,145.32 J1.11 ; PWM2_R.1 12.42,104.14 R5.1 ; R26.2 29.17,55.04 U5.2 29.17,60.14 28.14,61.16 22.24,61.16 20.95,59.88
  Bottom Layer w0.508: 20.95,59.88 20.95,58.14 20.47,57.66 15.7,57.66 14.07,59.28 14.07,85.75 10.92,88.9 10.92,102.87 v1(10.97,102.92)
PWM2_R_BUF: length 41.8
  Top Layer w0.508: 59.01,51.18 43.51,51.18 42.06,52.63 42.06,61.06 40.89,62.23 33.78,62.23 30.44,65.57 U5.18
PWM3_L: length 210.3
  Top Layer w0.508: PWM3_L.1 15.49,85.26 15.49,102.2 18.19,104.9 18.19,143.01 21.38,146.2 51.46,146.2 52.77,144.89 J1.8 ; PWM3_L.1 11.68,81.45 v1(11.68,81.43) ; PWM3_L.1 R9.1 ; H3.2 18.42,11 20.52,8.89 32.77,8.89 33.38,9.5 33.38,12.65 34.15,13.42 R37.2 36.18,13.42 37.59,14.83 U8.6
  Bottom Layer w0.508: H3.2 15.5,21.43 11.12,25.81 11.12,80.87 v1(11.68,81.43)
PWM3_L_BUF: length 24.1
  Top Layer w0.508: v1(43.69,23.11) 39.88,23.11 38.86,24.13 U8.14 ; U10.2 53.85,23.88 v1(53.59,23.62)
  Bottom Layer w0.508: v1(53.59,23.62) 53.09,23.11 v1(43.69,23.11)
PWM3_R: length 205.5
  Top Layer w0.508: 12.56,86.28 PWM3_R.1 14.88,88.59 14.88,102.46 17.58,105.15 17.58,143.26 21.13,146.81 53.75,146.81 55.54,145.02 J1.9 ; 12.56,86.28 v1(11.68,85.39) ; 12.56,86.28 R7.1 ; H3.1 30.64,21.43 32.51,19.56 U8.2 32.51,16.41 31.19,15.09 30.02,15.09 29.31,14.38 R35.2
  Bottom Layer w0.508: v1(11.68,85.39) 10.11,83.82 10.11,22.2 12.9,19.41 20.47,19.41 20.95,19.89 H3.1
PWM3_R_BUF: length 36.3
  Top Layer w0.508: U8.18 33.78,24 37.21,20.57 42.8,20.57 44.58,18.8 44.58,15.49 50.15,9.92 59.01,9.92
SPARE1: length 123.3
  Top Layer w0.508: Spare1.1 45.84,136.74 J1.18
  Bottom Layer w0.508: J1.18 45.84,144.5 44.04,146.3 16.35,146.3 4.02,133.97 4.02,69.34 5.6,67.76 SPARE_1.1
SPARE2: length 133.8
  Top Layer w0.508: Spare2.1 48.62,134.23 J1.19
  Bottom Layer w0.508: 47.5,146.91 16.1,146.91 3.41,134.22 3.41,66.7 4.89,65.22 SPARE_1.2 ; J1.19 48.62,145.8 47.5,146.91
SPARE3: length 146.7
  Top Layer w0.508: Spare3.1 59.63,144.36 J1.23
  Bottom Layer w0.508: J1.23 59.69,145.49 57.66,147.52 15.85,147.52 2.8,134.47 2.8,63.91 4.02,62.68 SPARE_1.3
SPARE4: length 156.3
  Top Layer w0.508: Spare4.1 62.43,144.39 J1.24
  Bottom Layer w0.508: SPARE_1.4 4.07,60.14 2.19,62.03 2.19,134.72 15.59,148.13 60.25,148.13 62.47,145.92 J1.24
SPARE5: length 161
  Top Layer w0.508: J1.25 65.18,144.37 Spare5.1
  Bottom Layer w0.508: J1.25 65.24,146.45 62.94,148.74 15.34,148.74 1.58,134.98 1.58,59.94 3.92,57.6 SPARE_1.5
$1N5026: length 7.6
  Top Layer w0.508: PWM_R1.2 7.32,123.6 R3.2
$1N6475: length 7.6
  Top Layer w0.508: R4.2 7.26,119.85 PWM_L1.1
$1N6556: length 7
  Top Layer w0.508: PWM_R2.2 6.69,104.89 R5.2
$1N6637: length 7.1
  Top Layer w0.762: PWM_R3.2 6.81,87.03 R7.2
$1N6809: length 6.9
  Top Layer w0.508: PWM_L2.1 6.63,101.64 R6.2
$1N6893: length 7.1
  Top Layer w0.762: PWM_L3.1 6.75,83.15 R9.2
$1N7000: length 7.7
  Top Layer w0.508: R10.2 7.17,115.9 EN_1.2
$1N7103: length 7.3
  Top Layer w0.508: EN_2.2 6.79,98.44 R11.2
$1N7182: length 7.2
  Top Layer w0.762: R12.2 6.66,78.93 EN_3.2
$1N7339: length 7.7
  Top Layer w0.762: PWR1.2 7.17,135.18 R8.2
$1N7791: length 2.5
  Top Layer w0.508: C1.2 90.92,127.38 U1.1
$1N7985: length 27.6
  Top Layer w0.508: v1(98.17,125.73) 97.47,126.43 U1.5 ; v1(86.23,113.79) R1.1
  Bottom Layer w0.508: v1(98.17,125.73) 89.41,125.73 86.23,122.56 v1(86.23,113.79)
$1N7989: length 8.3
  Top Layer w0.762: D1.1 83.94,113.44 Q1.4
  Top Layer w1.016: R2.2 83.44,109.74 ; 83.44,109.74 R1.2 ; 83.44,109.74 83.94,110.24 D1.1
$2N1023: length 6.6
  Top Layer w0.508: 59.01,83.83 56.88,83.83 54.74,85.98 R13.1
$2N1304: length 6.9
  Top Layer w0.508: R15.2 53.32,100.22 55.87,97.68 59.01,97.68
$2N2113: length 6.5
  Top Layer w0.508: R16.2 54.61,84.45 56.5,82.56 59.01,82.56
$2N2143: length 6.8
  Top Layer w0.508: R14.2 55.43,96.41 59.01,96.41
$2N6070: length 2.9
  Top Layer w0.762: R20.1 45.48,101.03 46.31,100.19 R21.2
$3N5041: length 5.8
  Top Layer w0.508: 59.01,47.37 55.11,47.37 R22.1
$3N5057: length 6.4
  Top Layer w0.508: 59.01,60.89 54.76,60.89 R24.2
$3N5085: length 5.7
  Top Layer w0.508: U6.6 54.94,46.1 R25.2
$3N5086: length 6.2
  Top Layer w0.508: R23.2 54.44,59.62 U7.6
$3N5119: length 3.5
  Top Layer w0.762: R30.2 46.74,63.54 R29.1
$4N5103: length 6.5
  Top Layer w0.508: U9.5 R31.1
$4N5119: length 6.9
  Top Layer w0.508: U10.5 52.82,20.07 R33.2
$4N5147: length 6.5
  Top Layer w0.508: 59.01,4.84 52.68,4.84 R34.2
$4N5148: length 6.9
  Top Layer w0.508: R32.2 52.62,18.8 U10.6
$4N5181: length 3.7
  Top Layer w0.508: R39.2 46.58,23.46 R38.1

## Copper pours and planes (outline as drawn; the poured copper is in the pictures)
+5V on Inner2: 100,0 76.66,0 76.66,104.5 77.21,105.05 100,105.05
GND on Top Layer: 0,150.11 56.38,150.11 56.38,0 0,0
GND on Bottom Layer: 0,150.11 56.26,150.11 56.26,0 0,0
GND on Inner1: 0,150.11 100.08,150.11 100.08,0 0,0
VBAT on Inner2: 0,0 40.51,0 40.64,-0.13 40.64,109.63 100,109.63 100,150.11 0,150.11
VBAT_M1 on Inner2: 41.15,113.92 73.99,113.92 73.99,80.34 41.15,80.34
VBAT_M2 on Inner2: 41.15,79.76 73.99,79.76 73.99,43.46 41.15,43.46
VBAT_M3 on Inner2: 41.15,42.62 73.94,42.62 73.94,0 41.15,0
M1+ on Top Layer: 56.64,84.45 56.64,85.85 61.47,85.85 61.47,90.3 91.78,90.3 91.78,76.88 61.47,76.88 61.47,84.45
M1+ on Bottom Layer: 56.64,84.45 56.64,85.85 61.47,85.85 61.47,90.3 91.78,90.3 91.78,76.93 61.47,76.93 61.47,84.45
M1- on Top Layer: 56.51,99.67 56.51,98.17 61.47,98.17 61.47,91.33 91.91,91.33 91.91,76.94 99.89,76.94 99.89,103.93 61.47,103.93 61.47,99.67
M1- on Bottom Layer: 56.51,99.67 56.51,98.17 61.47,98.17 61.47,91.33 91.91,91.33 91.91,76.94 99.78,76.94 99.78,103.93 61.47,103.93 61.47,99.67
M2+ on Top Layer: 56.51,49.4 56.51,47.88 61.34,47.88 61.34,39.42 91.59,39.42 91.59,53.21 61.34,53.21 61.34,49.4
M2+ on Bottom Layer: 56.39,49.28 56.39,47.75 61.21,47.75 61.21,39.45 91.57,39.45 91.57,53.09 61.21,53.09 61.21,49.28
M2- on Top Layer: 56.51,62.86 56.51,61.47 61.34,61.47 61.34,53.72 92.58,53.72 92.58,39.42 99.94,39.42 99.94,67.31 61.34,67.31 61.34,62.86
M2- on Bottom Layer: 56.51,62.86 56.51,61.47 61.34,61.47 61.34,53.72 92.58,53.72 92.58,39.42 99.94,39.42 99.94,67.31 61.34,67.31 61.34,62.86
M3+ on Top Layer: 56.51,6.6 61.21,6.6 61.21,0.07 90.81,0.07 90.81,9.4 91.86,9.4 91.86,14.5 61.09,14.5 61.09,8.13 56.51,8.13
M3+ on Bottom Layer: 56.39,6.6 61.09,6.6 61.09,0.12 90.78,0.12 90.78,9.4 91.86,9.4 91.86,14.5 61.09,14.5 61.09,8.13 56.39,8.13
M3- on Top Layer: 56.46,22.13 56.46,20.55 61.1,20.55 61.1,14.99 92.16,14.99 92.16,9.4 100.06,9.4 100.06,26.47 61.15,26.47 61.15,22.13
M3- on Bottom Layer: 56.46,22.13 56.46,20.55 61.1,20.55 61.1,14.99 92.16,14.99 92.16,9.4 100.06,9.4 100.06,26.47 61.15,26.47 61.15,22.13

Small or netless copper shapes (teardrops, artwork), in the pictures only: 266 on Top Layer, 49 on Bottom Layer, 28 on Inner2

## Text on the board
Top Silkscreen Layer: POT2 | OPT2 | OPT3 | POT3 | OPT1 | POT1 | +5V | GND | SPARE1 | SPARE2 | SPARE3 | SPARE5 | SPARE4 | MOTOR 3 | MOTOR 2 | MOTOR 1 | POWER | Krabby-Uno / v0.2
